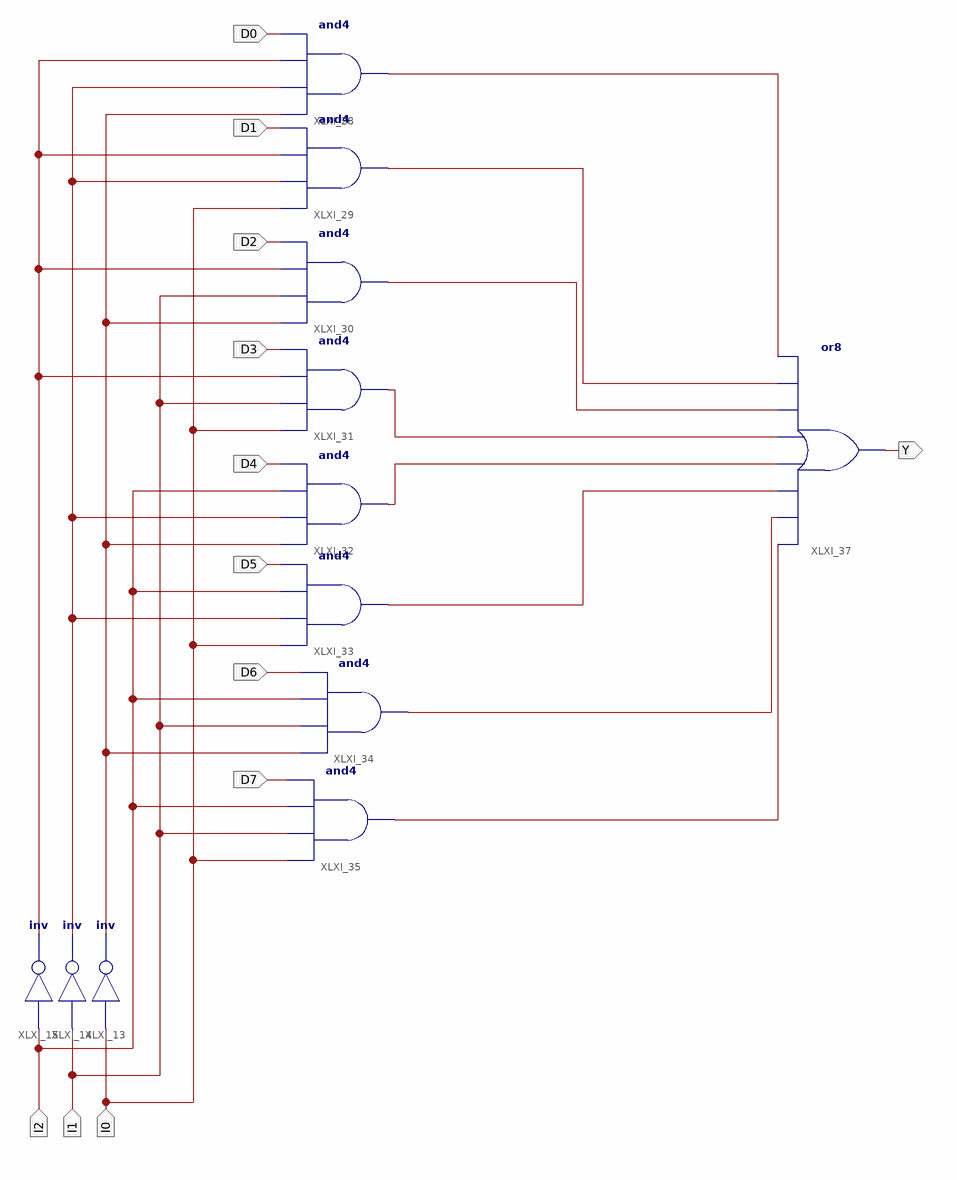
[diagram p0: schematic sheet 1]
// Xilinx ISE schematic MUX_8TO1.sch (spartan3e) as structural Verilog: 12 symbols, 12 ports
module MUX_8TO1 (
  input  I0,
  input  I1,
  input  I2,
  input  D0,
  input  D2,
  input  D3,
  input  D4,
  input  D5,
  input  D6,
  input  D7,
  input  D1,
  output Y
);

  wire XLXN_2, XLXN_4, XLXN_8, Y0, Y1, Y2, Y3, Y4, Y5, Y6, Y7;

  not XLXI_13 (XLXN_2, I0);
  not XLXI_14 (XLXN_8, I1);
  not XLXI_15 (XLXN_4, I2);
  and XLXI_28 (Y0, XLXN_2, XLXN_8, XLXN_4, D0);
  and XLXI_30 (Y2, XLXN_2, I1, XLXN_4, D2);
  and XLXI_31 (Y3, I0, I1, XLXN_4, D3);
  and XLXI_32 (Y4, XLXN_2, XLXN_8, I2, D4);
  and XLXI_33 (Y5, I0, XLXN_8, I2, D5);
  and XLXI_34 (Y6, XLXN_2, I1, I2, D6);
  and XLXI_35 (Y7, I0, I1, I2, D7);
  and XLXI_29 (Y1, I0, XLXN_8, XLXN_4, D1);
  or XLXI_37 (Y, Y7, Y6, Y5, Y4, Y3, Y2, Y1, Y0);
endmodule
